# Altium schematic sheet Sheet1 (4).SchDoc
size A4; SheetNumber: 1; SheetTotal: 1
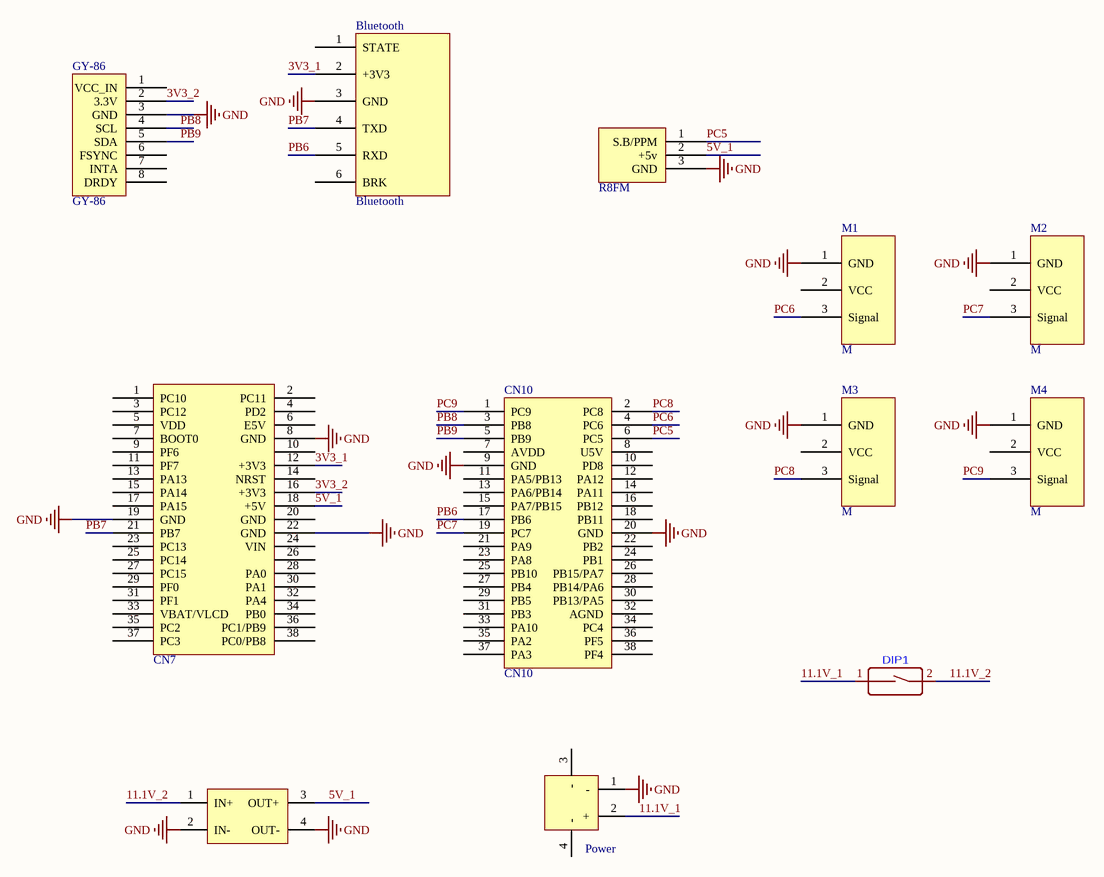
[diagram p0: Sheet1 (4).SchDoc]

## Parts
Bluetooth  Bluetooth  [bluetooth]
CN7  CN7  [Header 19X2]  (value not drawn)
CN10  CN10  [Header 19X2]
DIP1  (no value)  [SW]
GY-86  GY-86  [GY-86]
M1  M  [Motor]
M2  M  [Motor]
M3  M  [Motor]
M4  M  [Motor]
Power  Power  [Power]
R8FM  R8FM  [R8FM]
Voltage  *  [DM02]  (value not drawn)

## Nets
GND: Bluetooth.3(GND) CN7.8(GND) CN7.19(GND) CN7.22(GND) CN10.9(GND) CN10.20(GND) GY-86.3(GND) M1.1(GND) M2.1(GND) M3.1(GND) M4.1(GND) Power.1(-) R8FM.3(GND) Voltage.2(IN-) Voltage.4(OUT-)
3V3_1: Bluetooth.2(+3V3) CN7.12(+3V3)
3V3_2: CN7.16(+3V3) GY-86.2(3.3V)
5V_1: CN7.18(+5V) R8FM.2(+5v) Voltage.3(OUT+)
11.1V_1: DIP1.1 Power.2(+)
11.1V_2: DIP1.2 Voltage.1(IN+)
PB6: Bluetooth.5(RXD) CN10.17(PB6)
PB7: Bluetooth.4(TXD) CN7.21(PB7)
PB8: CN10.3(PB8) GY-86.4(SCL)
PB9: CN10.5(PB9) GY-86.5(SDA)
PC5: CN10.6(PC5) R8FM.1(S.B/PPM)
PC6: CN10.4(PC6) M1.3(Signal)
PC7: CN10.19(PC7) M2.3(Signal)
PC8: CN10.2(PC8) M3.3(Signal)
PC9: CN10.1(PC9) M4.3(Signal)

Not connected (* = marked no-connect by the designer): Bluetooth 1(STATE) 6(BRK); CN7 1(PC10) 2(PC11) 3(PC12) 4(PD2) 5(VDD) 6(E5V) 7(BOOT0) 9(PF6) 10 11(PF7) 13(PA13) 14(NRST) 15(PA14) 17(PA15) 20(GND) 23(PC13) 24(VIN) 25(PC14) 26 27(PC15) 28(PA0) 29(PF0) 30(PA1) 31(PF1) 32(PA4) 33(VBAT/VLCD) 34(PB0) 35(PC2) 36(PC1/PB9) 37(PC3) 38(PC0/PB8); CN10 7(AVDD) 8(U5V) 10(PD8) 11(PA5/PB13) 12(PA12) 13(PA6/PB14) 14(PA11) 15(PA7/PB15) 16(PB12) 18(PB11) 21(PA9) 22(PB2) 23(PA8) 24(PB1) 25(PB10) 26(PB15/PA7) 27(PB4) 28(PB14/PA6) 29(PB5) 30(PB13/PA5) 31(PB3) 32(AGND) 33(PA10) 34(PC4) 35(PA2) 36(PF5) 37(PA3) 38(PF4); GY-86 1(VCC_IN) 6(FSYNC) 7(INTA) 8(DRDY); M1 2(VCC); M2 2(VCC); M3 2(VCC); M4 2(VCC); Power 3(-) 4(-)

## Library data of the parts
DIP1 = 拨码开关 2.54*1
Voltage = Component_1